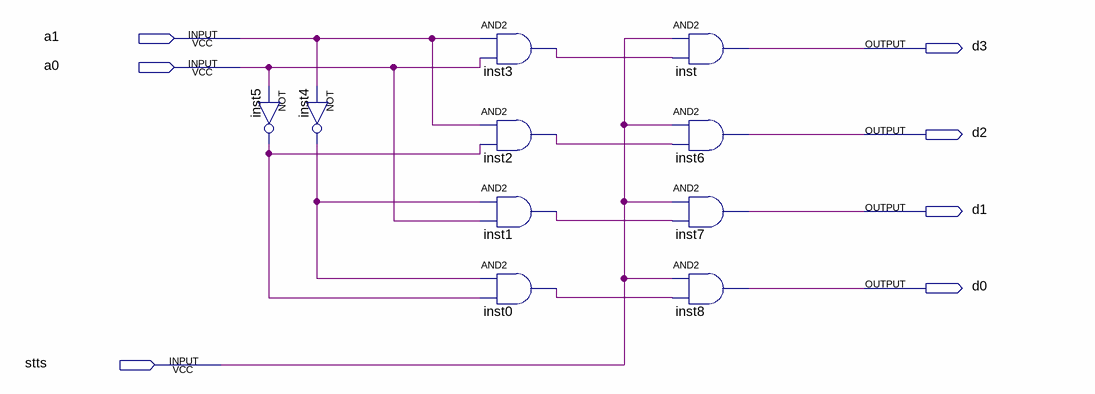
[diagram p0: schematic sheet]
// Quartus schematic decod2x4.bdf as structural Verilog: 10 symbols, 7 pins
module decod2x4 (
  input  a1,
  input  a0,
  input  stts,
  output d3,
  output d2,
  output d1,
  output d0
);

  wire inst0_out, inst1_out, inst2_out, inst3_out, inst4_out, inst5_out;

  not inst4 (inst4_out, a1);
  not inst5 (inst5_out, a0);
  and inst3 (inst3_out, a1, a0);
  and inst2 (inst2_out, a1, inst5_out);
  and inst1 (inst1_out, inst4_out, a0);
  and inst0 (inst0_out, inst4_out, inst5_out);
  and inst (d3, stts, inst3_out);
  and inst6 (d2, stts, inst2_out);
  and inst7 (d1, stts, inst1_out);
  and inst8 (d0, stts, inst0_out);
endmodule
